# EAGLE design relay (EAGLE 7.1.0)
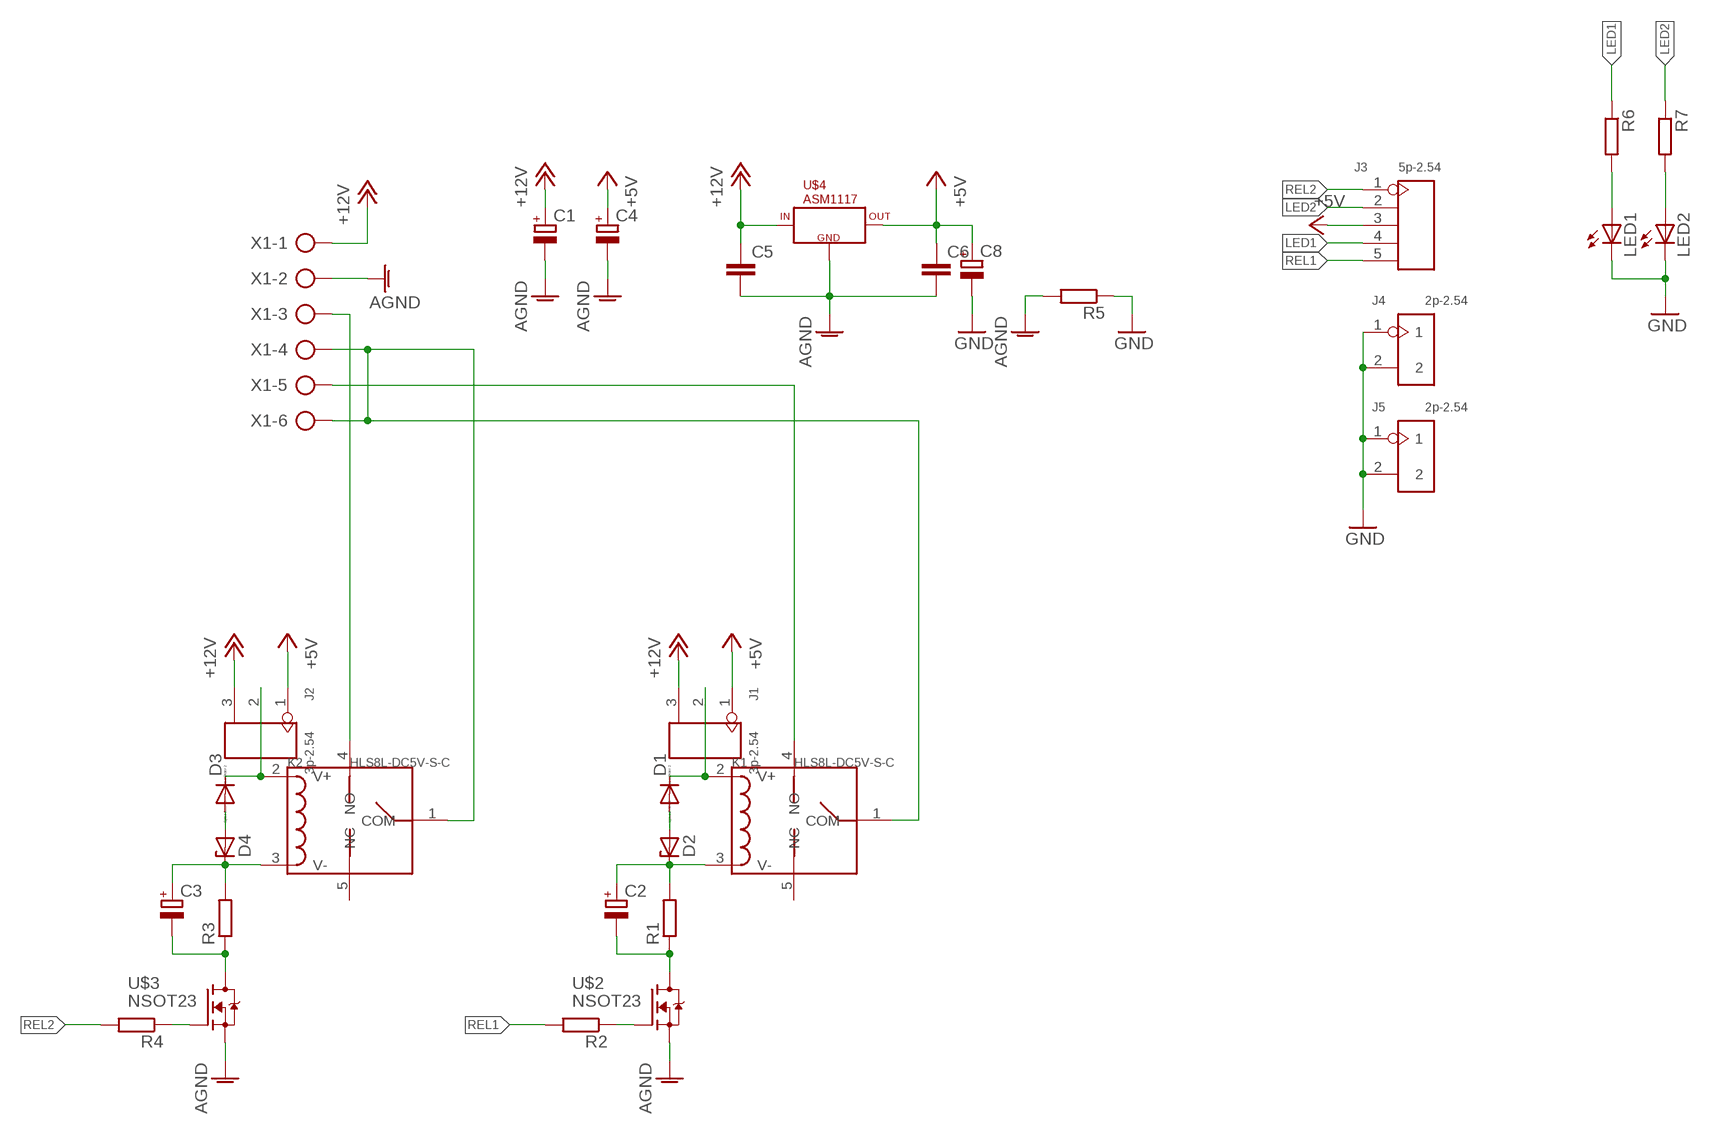
[diagram p0: schematic, sheet 1]

## Parts
C1  CPOL-EU153CLV-0405  [153CLV-0405]
C2  CPOL-EU153CLV-0405  [153CLV-0405]
C3  CPOL-EU153CLV-0405  [153CLV-0405]
C4  CPOL-EU153CLV-0405  [153CLV-0405]
C5  C-EUC0805  [C0805]
C6  C-EUC0805  [C0805]
C8  CPOL-EUSMCD  [SMC_D]
D1  DIODE-MINIMELF  [MINIMELF]
D2  ZENER-DIODESOD80C  [SOD80C]
D3  DIODE-MINIMELF  [MINIMELF]
D4  ZENER-DIODESOD80C  [SOD80C]
J1  3p-2.54  DIP-BLACK-FEMALE-HEADER-VERT(3P-2.54)  [H3-2.54]
J2  3p-2.54  DIP-BLACK-FEMALE-HEADER-VERT(3P-2.54)  [H3-2.54]
J3  5p-2.54  DIP-BLACK-FEMALE-HEADER-VERT(5P-2.54)  [H5-2.54]
J4  2p-2.54  DIP-BLACK-FEMALE-HEADER-VERT(2P-2.54)  [H2-2.54]
J5  2p-2.54  DIP-BLACK-FEMALE-HEADER-VERT(2P-2.54)  [H2-2.54]
K1  HLS8L-DC5V-S-C  RELAY-HLS8L-DC5V-S-C(5P-19X15MM)  [REY5-19.0X15.0X15.0MM]
K2  HLS8L-DC5V-S-C  RELAY-HLS8L-DC5V-S-C(5P-19X15MM)  [REY5-19.0X15.0X15.0MM]
LED1  LED5MM  [LED5MM]
LED2  LED5MM  [LED5MM]
R1  R-EU_R0805  [R0805]
R2  R-EU_R0805  [R0805]
R3  R-EU_R0805  [R0805]
R4  R-EU_R0805  [R0805]
R5  R-EU_R0805  [R0805]
R6  R-EU_R0805  [R0805]
R7  R-EU_R0805  [R0805]
U$2  NSOT23  [SOT23W]
U$3  NSOT23  [SOT23W]
U$4  ASM1117  [SOT223]
X1  AK500/6-H  [AK500/6-H]

## Nets
+5V: C4.+ C6.1 C8.+ J1.1 J2.1 J3.3 U$4.2(OUT) U$4.4(OUT)
+12V: C1.+ C5.1 J1.3 J2.3 U$4.3(IN) X1.1
AGND: C1.- C4.- C5.2 C6.2 R5.2 U$2.S U$3.S U$4.1(GND) X1.2
GND: C8.- J4.1 J4.2 J5.1 J5.2 LED1.K(C) LED2.K(C) R5.1
LED1: J3.4 R6.1
LED2: J3.2 R7.1
N$1: D1.C J1.2 K1.2(V+)
N$2: C2.+ D2.C K1.3(V-) R1.2
N$3: D1.A D2.A
N$4: C2.- R1.1 U$2.D
N$5: R2.1 U$2.G
N$6: K1.4(NO) X1.5
N$7: D3.C J2.2 K2.2(V+)
N$8: C3.+ D4.C K2.3(V-) R3.2
N$9: D3.A D4.A
N$10: C3.- R3.1 U$3.D
N$11: R4.1 U$3.G
N$12: LED1.A R6.2
N$13: K1.1(COM) K2.1(COM) X1.4 X1.6
N$14: LED2.A R7.2
N$15: K2.4(NO) X1.3
REL1: J3.5 R2.2
REL2: J3.1 R4.2
Unconnected: K1.5(NC) K2.5(NC)

## Library data of the parts
C1-C4 C8 = rcl:CPOL-EU: POLARIZED CAPACITOR, European symbol
C5 C6 = rcl:C-EU: CAPACITOR, European symbol
D1 D3 = diode:DIODE-: DIODE
D2 D4 = diode:ZENER-DIODE: Z-Diode
J1 J2 = Seeed-OPL-Connector:DIP-BLACK-FEMALE-HEADER-VERT(3P-2.54): 320030024; MPN: F185-1103A0BSYA1
J3 = Seeed-OPL-Connector:DIP-BLACK-FEMALE-HEADER-VERT(5P-2.54): 320030028; MPN: F185-1105A0BSYA1
J4 J5 = Seeed-OPL-Connector:DIP-BLACK-FEMALE-HEADER-VERT(2P-2.54): 320030023; MPN: F185-1102A1BSYA1
K1 K2 = Seeed-OPL-Relay:RELAY-HLS8L-DC5V-S-C(5P-19X15MM): 315030000; MPN: HLS8L-DC5V-S-C
LED1 LED2 = led:LED: LED OSRAM: - CHIPLED LG R971, LG N971, LY N971, LG Q971, LY Q971, LO R971, LY R971 LH N974, LH R974 LS Q976, LO Q976, LY Q976 LO Q996 - Hyper CHIPLED LW Q18S LB Q993, LB Q99A, LB R99A - SideLED LS A670, LO A670, LY A670, LG A670, LP A670 LB A673, LV A673, LT A673, LW A673 LH A674 LY A675 LS A676, LA A676, LO A676, LY A676, LW A676 LS A679, LY A679, LG A679 - Hyper Micro SIDELED® LS Y876, LA Y876, LO Y876, LY Y876 LT Y87S - SmartLED LW L88C, LW L88S LB L89C, LB L89S, LG L890 LS L89K, LO L89K, LY L89K LS L896, LA L896, LO L896, LY L896 - TOPLED LS T670, LO T670, LY T670, LG T670, LP T670 LSG T670, LSP T670, LSY T670, LOP T670, LYG T670 LG T671, LOG T671, LSG T671 LB T673, LV T673, LT T673, LW T673 LH T674 LS T676, LA T676, LO T676, LY T676, LB T676, LH T676, LSB T676, LW T676 LB T67C, LV T67C, LT T67C, LS T67K, LO T67K, LY T67K, LW E67C LS E67B, LA E67B, LO E67B, LY E67B, LB E67C, LV E67C, LT E67C LW T67C LS T679, LY T679, LG T679 LS T770, LO T770, LY T770, LG T770, LP T770 LB T773, LV T773, LT T773, LW T773 LH T774 LS E675, LA E675, LY E675, LS T675 LS T776, LA T776, LO T776, LY T776, LB T776 LHGB T686 LT T68C, LB T68C - Hyper Mini TOPLED® LB M676 - Mini TOPLED Santana® LG M470 LS M47K, LO M47K, LY M47K Source: http://www.osram.convergy.de LUXEON: - LUMILED® LXK2-PW12-R00, LXK2-PW12-S00, LXK2-PW14-U00, LXK2-PW14-V00 LXK2-PM12-R00, LXK2-PM12-S00, LXK2-PM14-U00 LXK2-PE12-Q00, LXK2-PE12-R00, LXK2-PE12-S00, LXK2-PE14-T00, LXK2-PE14-U00 LXK2-PB12-K00, LXK2-PB12-L00, LXK2-PB12-M00, LXK2-PB14-N00, LXK2-PB14-P00, LXK2-PB14-Q00 LXK2-PR12-L00, LXK2-PR12-M00, LXK2-PR14-Q00, LXK2-PR14-R00 LXK2-PD12-Q00, LXK2-PD12-R00, LXK2-PD12-S00 LXK2-PH12-R00, LXK2-PH12-S00 LXK2-PL12-P00, LXK2-PL12-Q00, LXK2-PL12-R00 Source: www.luxeon.com KINGBRIGHT: KA-3528ASYC Source: www.kingbright.com
R1-R7 = rcl:R-EU_: RESISTOR, European symbol
U$2 U$3 = Mosfet_Logic:NSOT23
U$4 = 74xx:ASM1117
X1 = con-ptr500:AK500/6-H: CONNECTOR Aug. 2004 / PTR Meßtechnik: Die Bezeichnung der Serie AK505 wurde geändert. Es handelt sich hierbei um AK500 in horizontaler Ausführung.

## Board
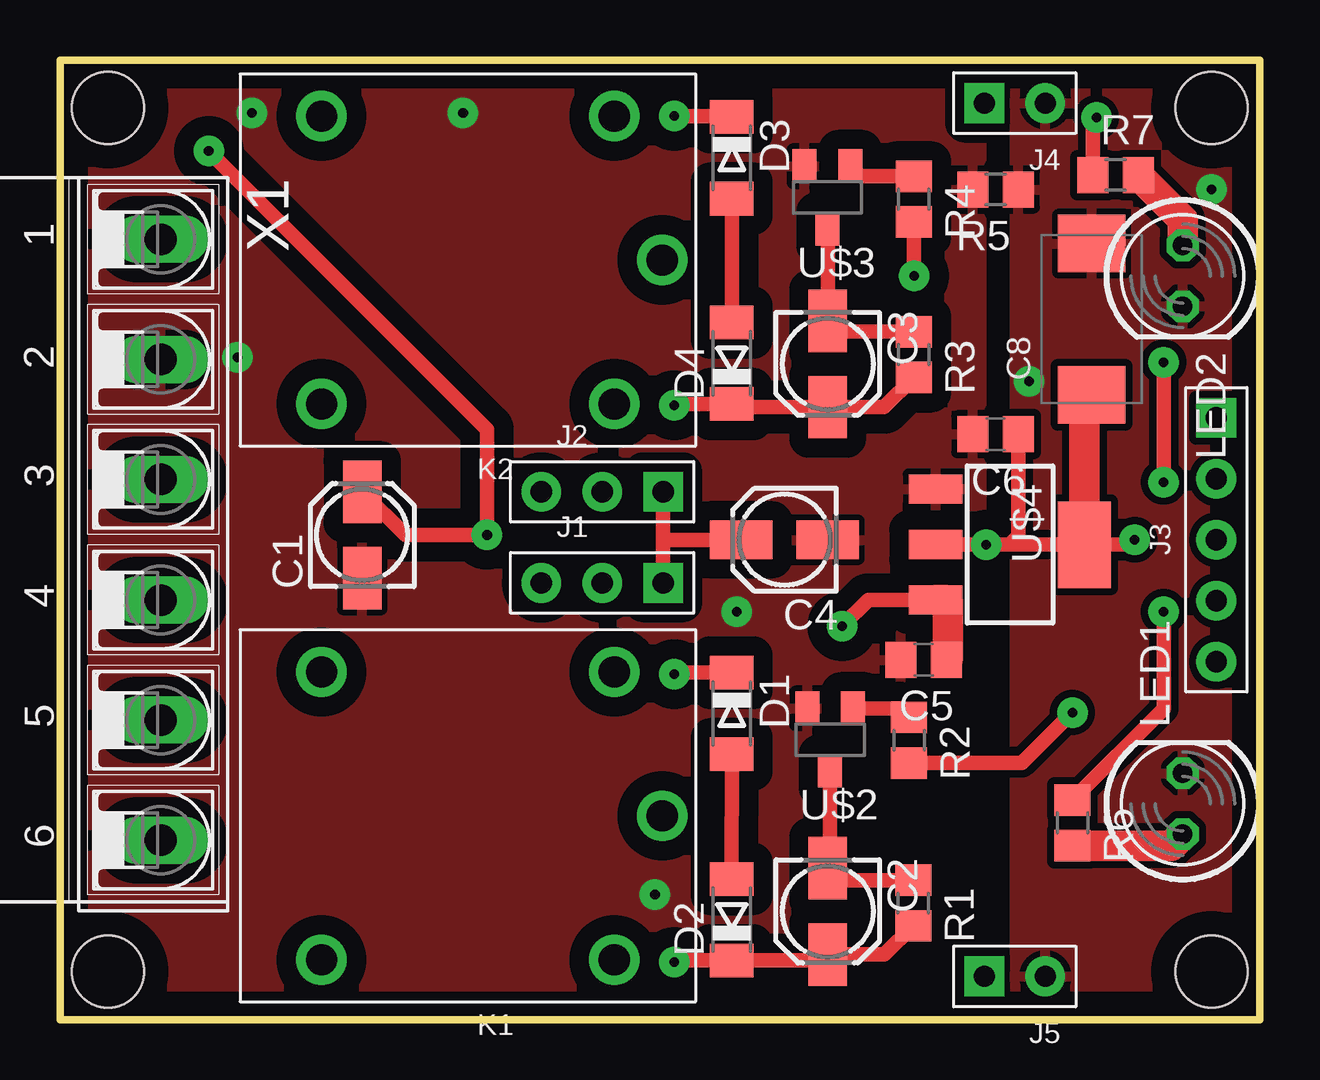
[diagram p1: board, top side]
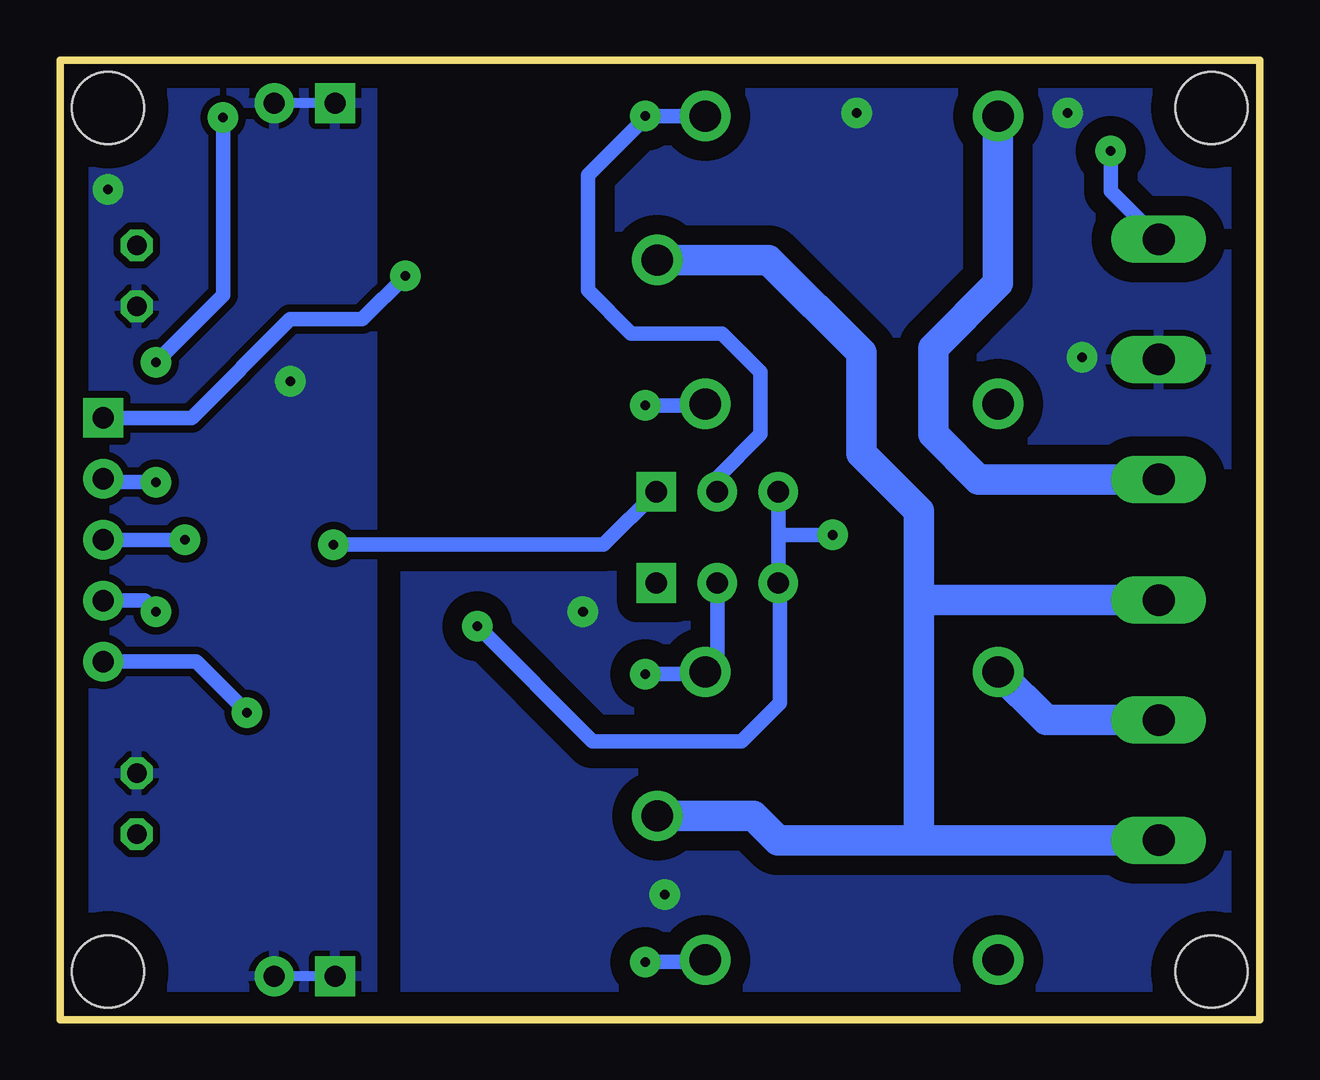
[diagram p2: board, bottom side, seen from below]

Size 50 x 40 mm. Coordinates in mm from the lower left corner, seen from the top.
Outline: 0,0 0,40 50,40 50,0 0,0
Copper layers (1*16): Top 0.035mm / dielectric 1.5mm / Bottom 0.035mm
Design rules "default": minimum track width 10mil, minimum drill 24mil, track to track 8mil, track to pad 8mil, pad to pad 8mil, via to via 8mil, smd to smd 8mil, copper to edge 40mil, drill to drill 8mil, minimum pad ring 10mil, minimum via ring 8mil, stop-mask expansion 4mil, vias tented up to drill 0mil, thermal gap 10mil
Holes 3 mm at 2,38 48,38 48,2 2,2

### Footprints (pad centres in the part's own frame; a part is rotated, then mirrored left to right if it is on the bottom)
153CLV-0405 = smd 2.6 x 1.6: + 1.8,0; - -1.8,0
C0805 = smd 1.3 x 1.5: 1 -0.95,0; 2 0.95,0
SMC_D = smd 2.4 x 2.8: + -3.15,0; - 3.15,0
MINIMELF = smd 1.4 x 1.8: A 1.7,0; C -1.7,0
SOD80C = smd 1.4 x 1.8: A 1.7,0; C -1.7,0
H3-2.54 = drill 0.889 pad 1.651 square: 1 0,2.54 | drill 0.889 pad 1.651: 2 0,0; 3 0,-2.54
H5-2.54 = drill 0.889 pad 1.651 square: 1 0,5.08 | drill 0.889 pad 1.651: 2 0,2.54; 3 0,0; 4 0,-2.54; 5 0,-5.08
H2-2.54 = drill 0.889 pad 1.651 square: 1 0,1.27 | drill 0.889 pad 1.651: 2 0,-1.27
REY5-19.0X15.0X15.0MM = drill 1.3 pad 2.1: 1 -8.1,0; 2 -6.1,-6; 3 -6.1,6; 4 6.1,-6; 5 6.1,6
LED5MM = drill 0.813 octagon: A -1.27,0; K 1.27,0
R0805 = smd 1.3 x 1.5: 1 -0.95,0; 2 0.95,0
SOT23W = smd 1 x 1.4: D 0,1.303; G -0.95,-1.303; S 0.95,-1.303
SOT223 = smd 1.219 x 2.235: 1 -2.311,-3.099; 2 0,-3.099; 3 2.311,-3.099 | smd 3.6 x 2.2: 4 0,3.099
AK500/6-H = drill 1.321 long: 1 -12.522,0; 2 -7.518,0; 3 -2.515,0; 4 2.515,0; 5 7.518,0; 6 12.522,0

### Placement (x,y rotation side)
C1  12.6,20.2 90 top
C2  32,4.51 270 top
C3  32,27.33 270 top
C4  30.2,20 180 top
C5  36,15 180 top
C6  39,24.4 180 top
C8  43,29.2 90 top
D1  28,12.76 270 top
D2  28,4.16 90 top
D3  28,35.92 270 top
D4  28,27.36 90 top
J1  22.6,18.2 270 top
J2  22.6,22 270 top
J3  48.2,20 0 top
J4  39.8,38.2 90 top
J5  39.8,1.8 90 top
K1  17,8.49 180 top
K2  17,31.66 180 top
LED1  46.8,9 90 top
LED2  46.8,31 270 top
R1  35.57,4.86 270 top
R2  35.39,11.64 270 top
R3  35.59,27.72 270 top
R4  35.59,34.2 270 top
R5  39,34.6 180 top
R6  42.2,8.2 270 top
R7  44,35.2 0 top
U$2  32.1,11.67 180 top
U$3  31.99,34.27 180 top
U$4  39.6,19.8 270 top
X1  4.2,20 270 top

### Tracks (layer width: path | path; a pad name or v marks a point on that pad's centre or on a via)
+5V  (via drill 0.4 pad 1.27)
  Top 0.61: J2.1 25.14,20 | 25.14,20 J1.1 | C4.+ 25.14,20 | U$4.2 v38.6,19.8 | v44.8,20 44.6,19.8 U$4.4 v38.6,19.8 | C6.1 39.95,20.15 39.6,19.8 v38.6,19.8
  Top 1.27: C8.+ 42.7,25.75 U$4.4
  Bottom 0.61: v38.6,19.8 27.34,19.8 J2.1 | v44.8,20 J3.3
+12V  (via drill 0.4 pad 1.27)
  Top 0.61: v6.2,36.2 17.8,24.6 v17.8,20.2 14.4,20.2 C1.+ | U$4.3 33.69,17.49 v32.6,16.4
  Top 1.27: C5.1 37,15.05 37,17.4 36.91,17.49 U$4.3
  Bottom 0.61: 20.06,20.2 J1.3 20,18.14 20,13.2 21.6,11.6 27.8,11.6 v32.6,16.4 | 20.06,20.2 J2.3 | X1.1 6.2,34.52 v6.2,36.2 | v17.8,20.2 20.06,20.2
AGND  (via drill 0.4 pad 1.27)
  other vias: 7.4,27.6 24.8,5.2 28.2,17 8,37.8 16.8,37.8
  pour Top (isolate 0.813): 0,0 0,40 38.4,40 38.4,0
  pour Bottom (isolate 0.813): 35.6,0 35.6,40 0,40 0,0
GND  (via drill 0.4 pad 1.27)
  Bottom 0.406: J5.1 J5.2 | J4.1 J4.2
  other vias: 48,34.6 40.4,26.6
  pour Top (isolate 0.305): 50,0 39.8,0 39.8,40 50,40
  pour Bottom (isolate 0.305): 37,0 50,0 50,40 37,40
LED1  (via drill 0.4 pad 1.27)
  Top 0.61: v46,17 46,12.95 R6.1
  Bottom 0.61: J3.4 46.46,17.46 v46,17
LED2  (via drill 0.4 pad 1.27)
  Top 0.61: v46,22.4 v46,27.4 | v43.2,37.6 43.05,37.45 R7.1
  Bottom 0.61: J3.2 48.06,22.4 v46,22.4 | v46,27.4 43.2,30.2 v43.2,37.6
N$1  (via drill 0.4 pad 1.27)
  Top 0.61: D1.C 25.86,14.46 v25.6,14.4
  Bottom 0.61: J1.2 22.6,14.99 K1.2 23.19,14.4 v25.6,14.4
N$2  (via drill 0.4 pad 1.27)
  Top 0.61: v25.6,2.4 25.86,2.46 D2.C 31.79,2.46 C2.+ 34.37,2.71 R1.2
  Bottom 0.61: v25.6,2.4 23.19,2.4 K1.3
N$3
  Top 0.61: D1.A 27.99,5.88 D2.A
N$4
  Top 0.61: U$2.D 32.1,6.37 C2.- 32.54,5.81 R1.1
N$5
  Top 0.61: U$2.G 35.01,12.97 R2.1
N$6
  Bottom 1.27: X1.5 8.89,12.48 K1.4
N$7  (via drill 0.4 pad 1.27)
  Top 0.61: D3.C 27.96,37.66 v25.6,37.66
  Bottom 0.61: J2.2 22.6,22.6 20.8,24.4 20.8,27 22.4,28.6 26.2,28.6 28,30.4 28,35.2 25.54,37.66 v25.6,37.66 K2.2
N$8  (via drill 0.4 pad 1.27)
  Top 0.61: v25.6,25.6 25.66,25.66 D4.C 28.13,25.53 31.4,25.53 C3.+ 34.35,25.53 R3.2
  Bottom 0.61: K2.3 23.16,25.6 v25.6,25.6
N$9
  Top 0.61: D3.A D4.A
N$10
  Top 0.61: R3.1 32.46,28.67 C3.- 32,32.96 U$3.D
N$11
  Top 0.61: U$3.G 33.36,35.15 R4.1
N$12
  Top 1.27: LED1.A 46.32,7.25 R6.2
N$13
  Bottom 1.27: K2.1 20.46,31.66 16.6,27.8 16.6,23.6 14.2,21.2 14.2,17.6 | 8.29,17.48 X1.4 14.09,17.48 14.2,17.6 | X1.6 14.2,7.48 | 14.2,7.48 20.08,7.48 21.09,8.49 K1.1 | 14.2,17.6 14.2,7.48
N$14
  Top 1.27: R7.2 46.8,33.35 LED2.A
N$15
  Bottom 1.27: X1.3 11.71,22.52 13.6,24.4 13.6,28 10.9,30.7 K2.4
REL1  (via drill 0.4 pad 1.27)
  Top 0.61: R2.2 40.09,10.69 v42.2,12.8
  Bottom 0.61: v42.2,12.8 44.32,14.92 J3.5
REL2  (via drill 0.4 pad 1.27)
  Top 0.61: v35.6,31 R4.2
  Bottom 0.61: J3.1 44.52,25.08 40.4,29.2 37.4,29.2 v35.6,31